# EAGLE design circut-v2 (EAGLE 8.4.1)
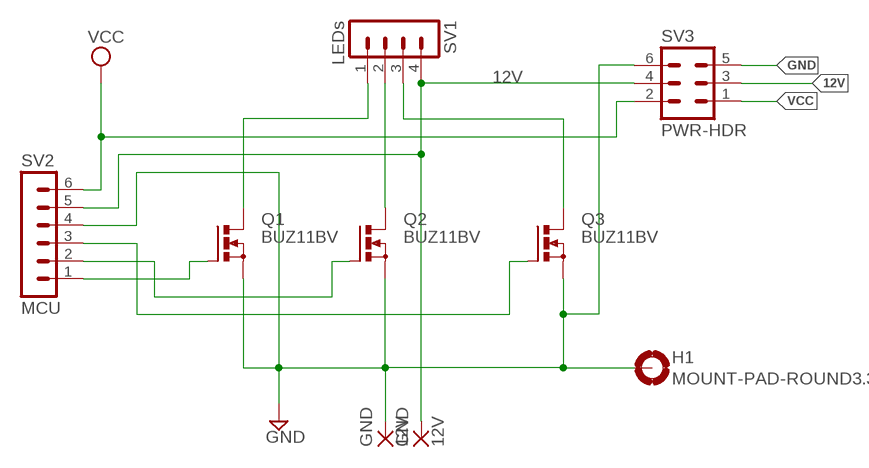
[diagram p0: schematic, sheet 1]

## Parts
12V  12V  3,17/1,3  [3,17/1,3]
GND  GND  3,17/1,3  [3,17/1,3]
H1  MOUNT-PAD-ROUND3.3  [3,3-PAD]
Q1  BUZ11BV  [TO220BV]
Q2  BUZ11BV  [TO220BV]
Q3  BUZ11BV  [TO220BV]
SV1  LEDs  MA04-1  [MA04-1]
SV2  MCU  MA06-1  [MA06-1]
SV3  PWR-HDR  MA03-2  [MA03-2]

## Nets
12V: 12V.1(P) SV1.4 SV2.5 SV3.3 SV3.4
C1: Q1.G SV2.1
C2: Q2.G SV2.2
C3: Q3.G SV2.3
GND: GND.1(P) H1.B3,3(MOUNT) Q1.S Q2.S Q3.S SV2.4 SV3.5 SV3.6
L1: Q1.D SV1.1
L2: Q2.D SV1.2
L3: Q3.D SV1.3
VCC: SV2.6 SV3.1 SV3.2

## Library data of the parts
12V GND = wirepad:3,17/1,3: THROUGH-HOLE PAD
H1 = holes:MOUNT-PAD-ROUND: MOUNTING PAD, round
Q1-Q3 = transistor-power:BUZ11: N-CHANNEL MOS FET
SV1 = con-lstb:MA04-1: PIN HEADER; OC_FARNELL: unknown; OC_NEWARK: unknown
SV2 = con-lstb:MA06-1: PIN HEADER; OC_FARNELL: unknown; OC_NEWARK: unknown
SV3 = con-lstb:MA03-2: PIN HEADER; OC_FARNELL: unknown; OC_NEWARK: unknown

## Board
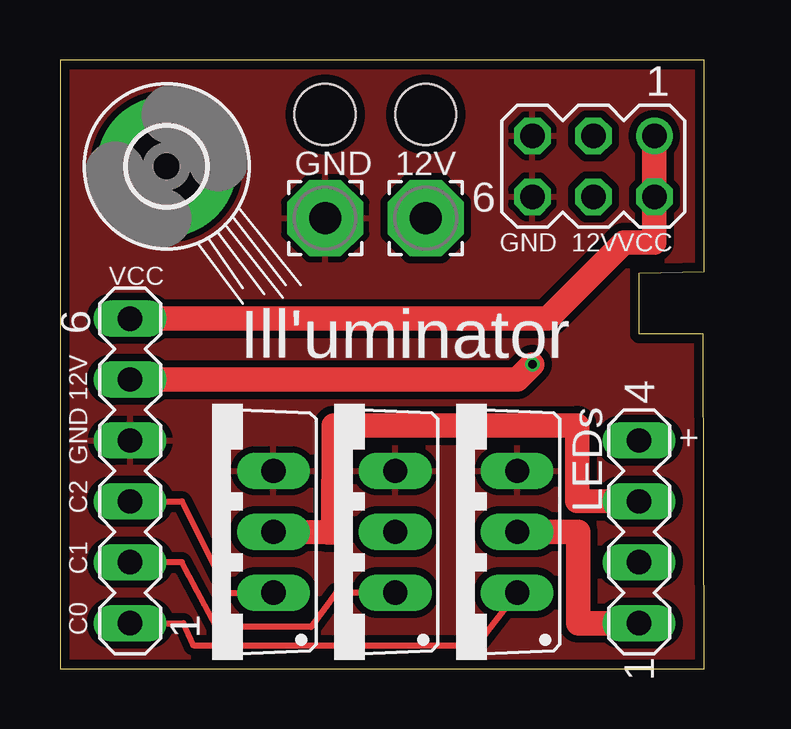
[diagram p1: board, top side]
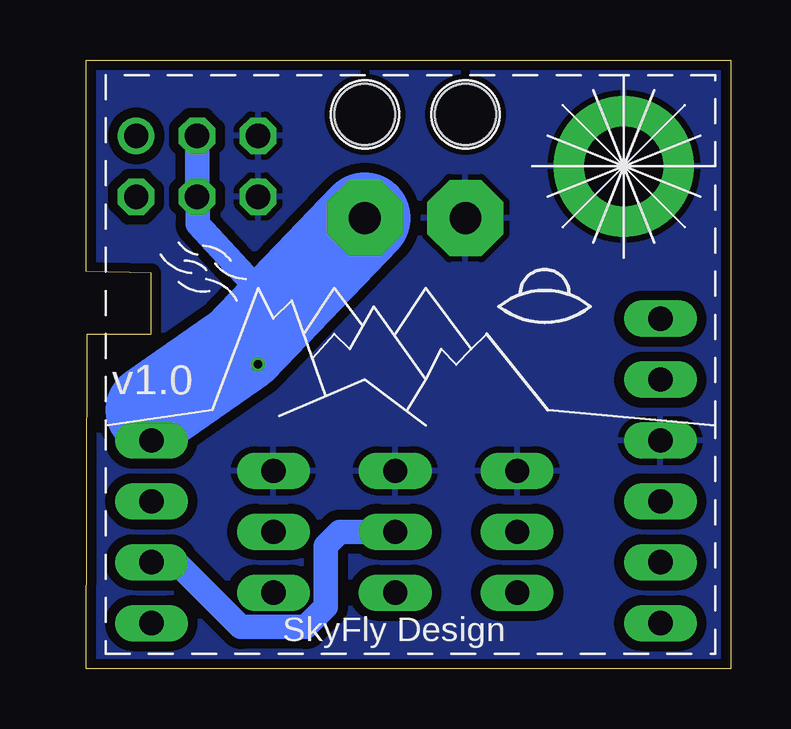
[diagram p2: board, bottom side, seen from below]

Size 26.85 x 25.39 mm. Coordinates in mm from the lower left corner, seen from the top.
Outline: 0,0 26.85,0 26.8,13.97 24.13,13.97 24.13,16.51 26.85,16.56 26.85,25.39 0,25.39 0,0
Copper layers (1*16): Top 0.035559375mm / dielectric 1.6mm / Bottom 0.035559375mm
Design rules "oshpark-2layer": minimum track width 6mil, minimum drill 10mil, track to track 6mil, track to pad 6mil, pad to pad 6mil, via to via 6mil, smd to smd 6mil, copper to edge 15mil, drill to drill 6mil, minimum pad ring 5mil, minimum via ring 5mil, stop-mask expansion 2.5mil, vias tented up to drill 0mil, thermal gap 10mil
Holes 2.54 mm at 11.05,23.11 15.24,23.11

### Footprints (pad centres in the part's own frame; a part is rotated, then mirrored left to right if it is on the bottom)
3,17/1,3 = drill 1.321 pad 3.175 octagon: 1 0,0
3,3-PAD = drill 3.3 pad 5.842: B3,3 0,0
TO220BV = drill 1.016 long: D 0,-2.54; G -2.54,-2.54; S 2.54,-2.54
MA04-1 = drill 1.016 long: 1 -3.81,0; 2 -1.27,0; 3 1.27,0; 4 3.81,0
MA06-1 = drill 1.016 long: 1 -6.35,0; 2 -3.81,0; 3 -1.27,0; 4 1.27,0; 5 3.81,0; 6 6.35,0
MA03-2 = drill 1.016: 1 -2.54,-1.27 | drill 1.016 octagon: 2 -2.54,1.27; 3 0,-1.27; 4 0,1.27; 5 2.54,-1.27; 6 2.54,1.27

### Placement (x,y rotation side)
12V  15.24,18.8 0 top
GND  11.05,18.8 0 top
H1  4.45,20.95 0 top
Q1  16.51,5.71 90 top
Q2  11.43,5.71 90 top
Q3  6.35,5.71 90 top
SV1  24.13,5.71 90 top
SV2  2.92,8.26 90 top
SV3  22.23,20.95 180 top

### Tracks (layer width: path | path; a pad name or v marks a point on that pad's centre or on a via)
12V  (via drill 0.35)
  Top 1.016: SV2.5 19.05,12.06 v19.68,12.7
  Bottom 1.016: 12V.1 15.98,18.26 19,15.09 22.2,18.54 SV3.4 SV3.3 | v19.68,12.7 20.41,13.4 | 24.13,10.79 SV1.4
  Bottom 3.81: 12V.1 20.41,13.4 24.13,10.79
C1
  Top 0.254: SV2.1 5.14,1.91 5.55,0.99 17.37,0.99 Q1.G
C2
  Top 0.254: Q2.G 11.51,3.17 10.46,1.75 6.5,1.75 5.08,4.45 SV2.2
C3
  Top 0.254: SV2.3 5.08,6.99 6.99,3.17 Q3.G
GND
  pour Bottom (isolate 0.406): 0,25.4 26.67,25.4 26.67,16.51 24.13,16.51 24.13,13.97 26.67,13.97 26.67,0 0,0
  pour Top (isolate 0.305): 0,25.4 26.67,25.4 26.67,16.51 24.13,16.51 24.13,13.97 26.67,13.97 26.67,0 0,0
L1
  Top 1.016: SV1.1 21.59,1.91 21.59,5.71 Q1.D
L2
  Bottom 1.016: Q2.D 16.28,5.71 16.87,5.13 16.87,2.59 17.7,1.75 20.4,1.75 23.09,4.45 SV1.2
L3
  Top 1.016: SV1.3 23.09,6.99 21.54,7.01 21.54,10.15 11.4,10.15 11.38,5.69 11.15,5.69 Q3.D
VCC
  Top 1.016: SV2.6 20.32,14.61 23.5,17.78 24.77,17.78 SV3.2 SV3.1

### Text on the board
tPlace: Ill'uminator | +
bPlace: v1.0 | SkyFly Design